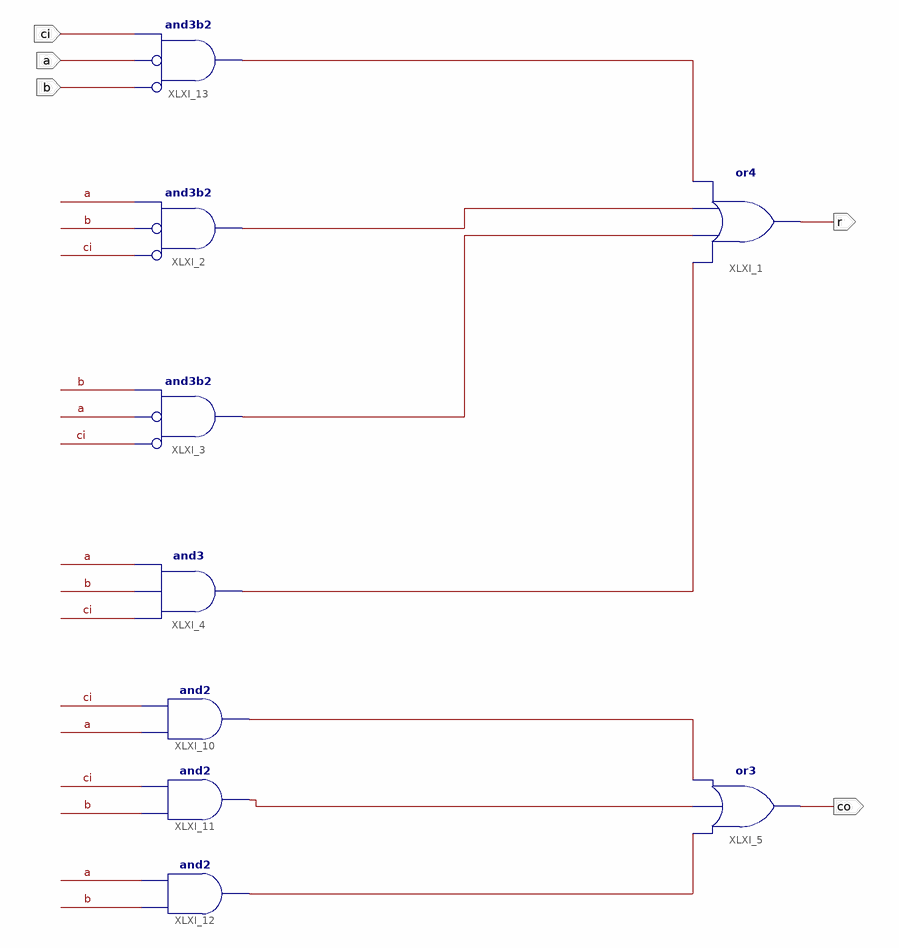
[diagram p0: schematic sheet 1]
// Xilinx ISE schematic add1b.sch (spartan3e) as structural Verilog: 9 symbols, 5 ports
module add1b (
  input  ci,
  input  a,
  input  b,
  output r,
  output co
);

  wire XLXN_3, XLXN_4, XLXN_5, XLXN_6, XLXN_13, XLXN_14, XLXN_15;

  or XLXI_1 (r, XLXN_6, XLXN_4, XLXN_3, XLXN_5);
  and XLXI_2 (XLXN_3, ~ci, ~b, a);  // and3b2
  and XLXI_3 (XLXN_4, ~ci, ~a, b);  // and3b2
  and XLXI_4 (XLXN_6, ci, b, a);
  or XLXI_5 (co, XLXN_15, XLXN_14, XLXN_13);
  and XLXI_10 (XLXN_13, a, ci);
  and XLXI_11 (XLXN_14, b, ci);
  and XLXI_12 (XLXN_15, b, a);
  and XLXI_13 (XLXN_5, ~b, ~a, ci);  // and3b2
endmodule
